# Altium schematic sheet GSM.SchDoc
size A; SheetNumber: 3; SheetTotal: 3
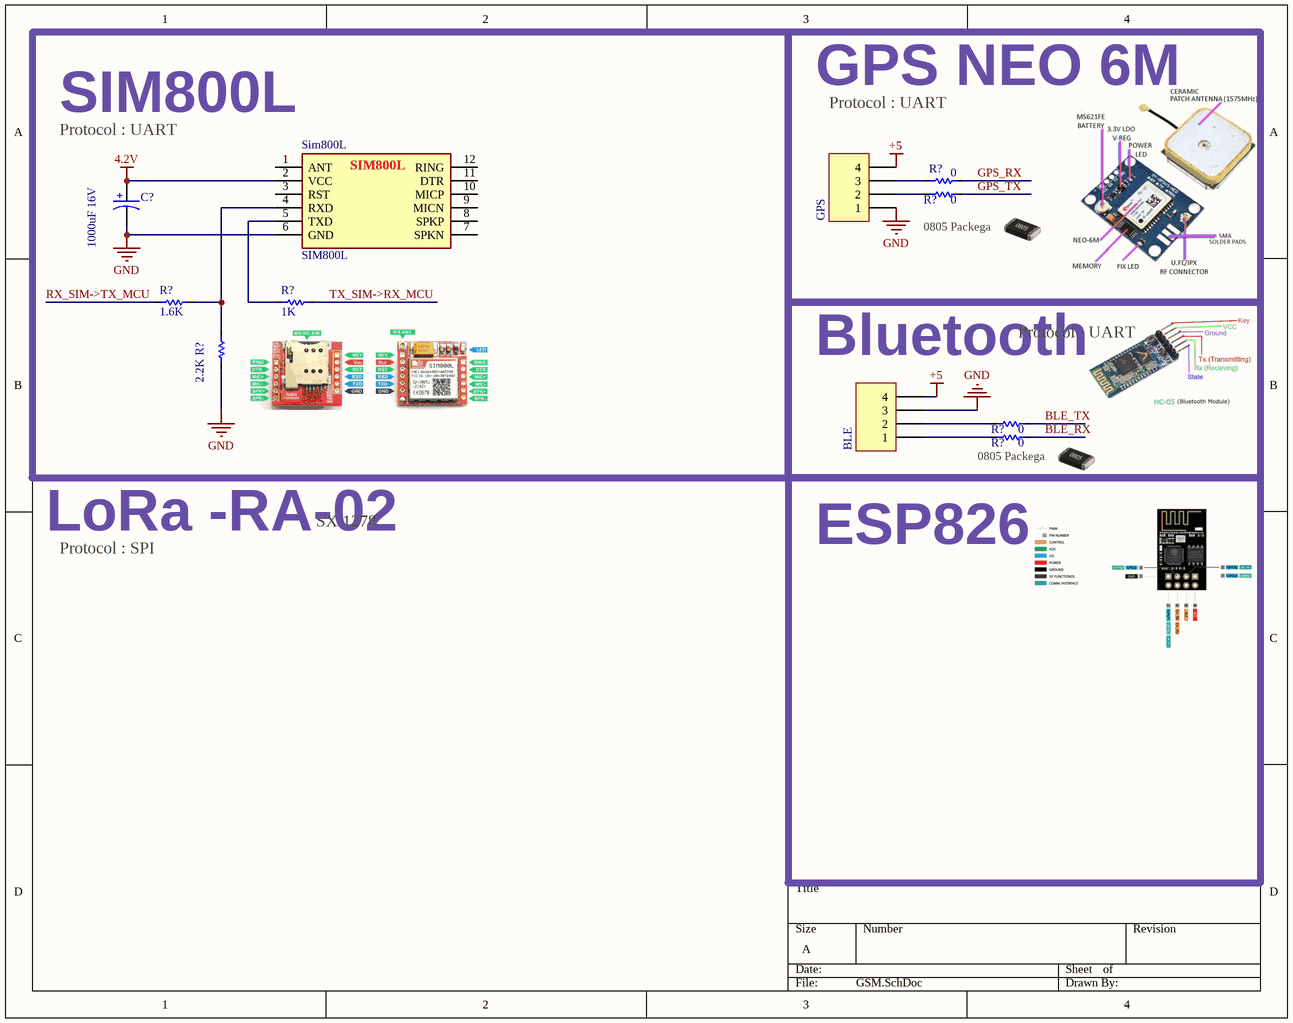
[diagram p0: GSM.SchDoc]

## Parts
(Parts that share a designator on the sheet are numbered #1, #2 ... from top to bottom, then left to right.)
BLE  Header 4  [My_1X04]  (value not drawn)
C?  1000uF 16V  [SMD_1000uf 16V]
GPS  Header 4  [My_1X04]  (value not drawn)
R?#1  0  [0805]
R?#2  0  [0805]
R?#3  1.6K  [1206_Res]
R?#4  1K  [1206_Res]
R?#5  2.2K  [1206_Res]
R?#6  0  [0805]
R?#7  0  [0805]
Sim800L  SIM800L  [SIM800L]

## Blocks framed on the sheet
SIM800L: C? R?#3-R?#5 Sim800L
GPS NEO 6M: GPS R?#1 R?#2
Bluetooth: BLE R?#6 R?#7

## Nets
4.2V: C?.1 Sim800L.2(VCC)
+5: BLE.4 GPS.4
GND: BLE.3 C?.2 GPS.1 R?#5.1 Sim800L.6(GND)
BLE_RX: R?#7.2
BLE_TX: R?#6.2
GPS_RX: R?#1.2
GPS_TX: R?#2.2
RX_SIM->TX_MCU: R?#3.2
TX_SIM->RX_MCU: R?#4.1
NetBLE_1: BLE.1 R?#7.1
NetBLE_2: BLE.2 R?#6.1
NetGPS_2: GPS.2 R?#2.1
NetGPS_3: GPS.3 R?#1.1
NetR?#3_1: R?#3.1 R?#5.2 Sim800L.4(RXD)
NetR?#4_2: R?#4.2 Sim800L.5(TXD)

Not connected (* = marked no-connect by the designer): Sim800L 1(ANT) 3(RST) 7(SPKN) 8(SPKP) 9(MICN) 10(MICP) 11(DTR) 12(RING)

## Notes on the sheet
- Protocol : UART
- (near R?#2) 0805 Packega
- (near R?#7) 0805 Packega
- LoRa -RA-02
- Protocol : SPI
- SX 1278
- ESP8266
- (in symbol Capacitor) +

## Library data of the parts
BLE GPS = Header 4: Header, 4-Pin; LatestRevisionDate: 17-Jul-2002; LatestRevisionNote: Re-released for DXP Platform.; Publisher: Altium Limited
C? = Capacitor: Electrolyte Capacitor
R?#1-R?#7 = Res: Resistor; Published: 8-Jun-2000; LatestRevisionDate: 17-Jul-2002; LatestRevisionNote: Re-released for DXP Platform.; PackageReference: AXIAL-0.3; Publisher: Altium Limited
Sim800L = SIM800L: Publisher: 3DFootprint.ir